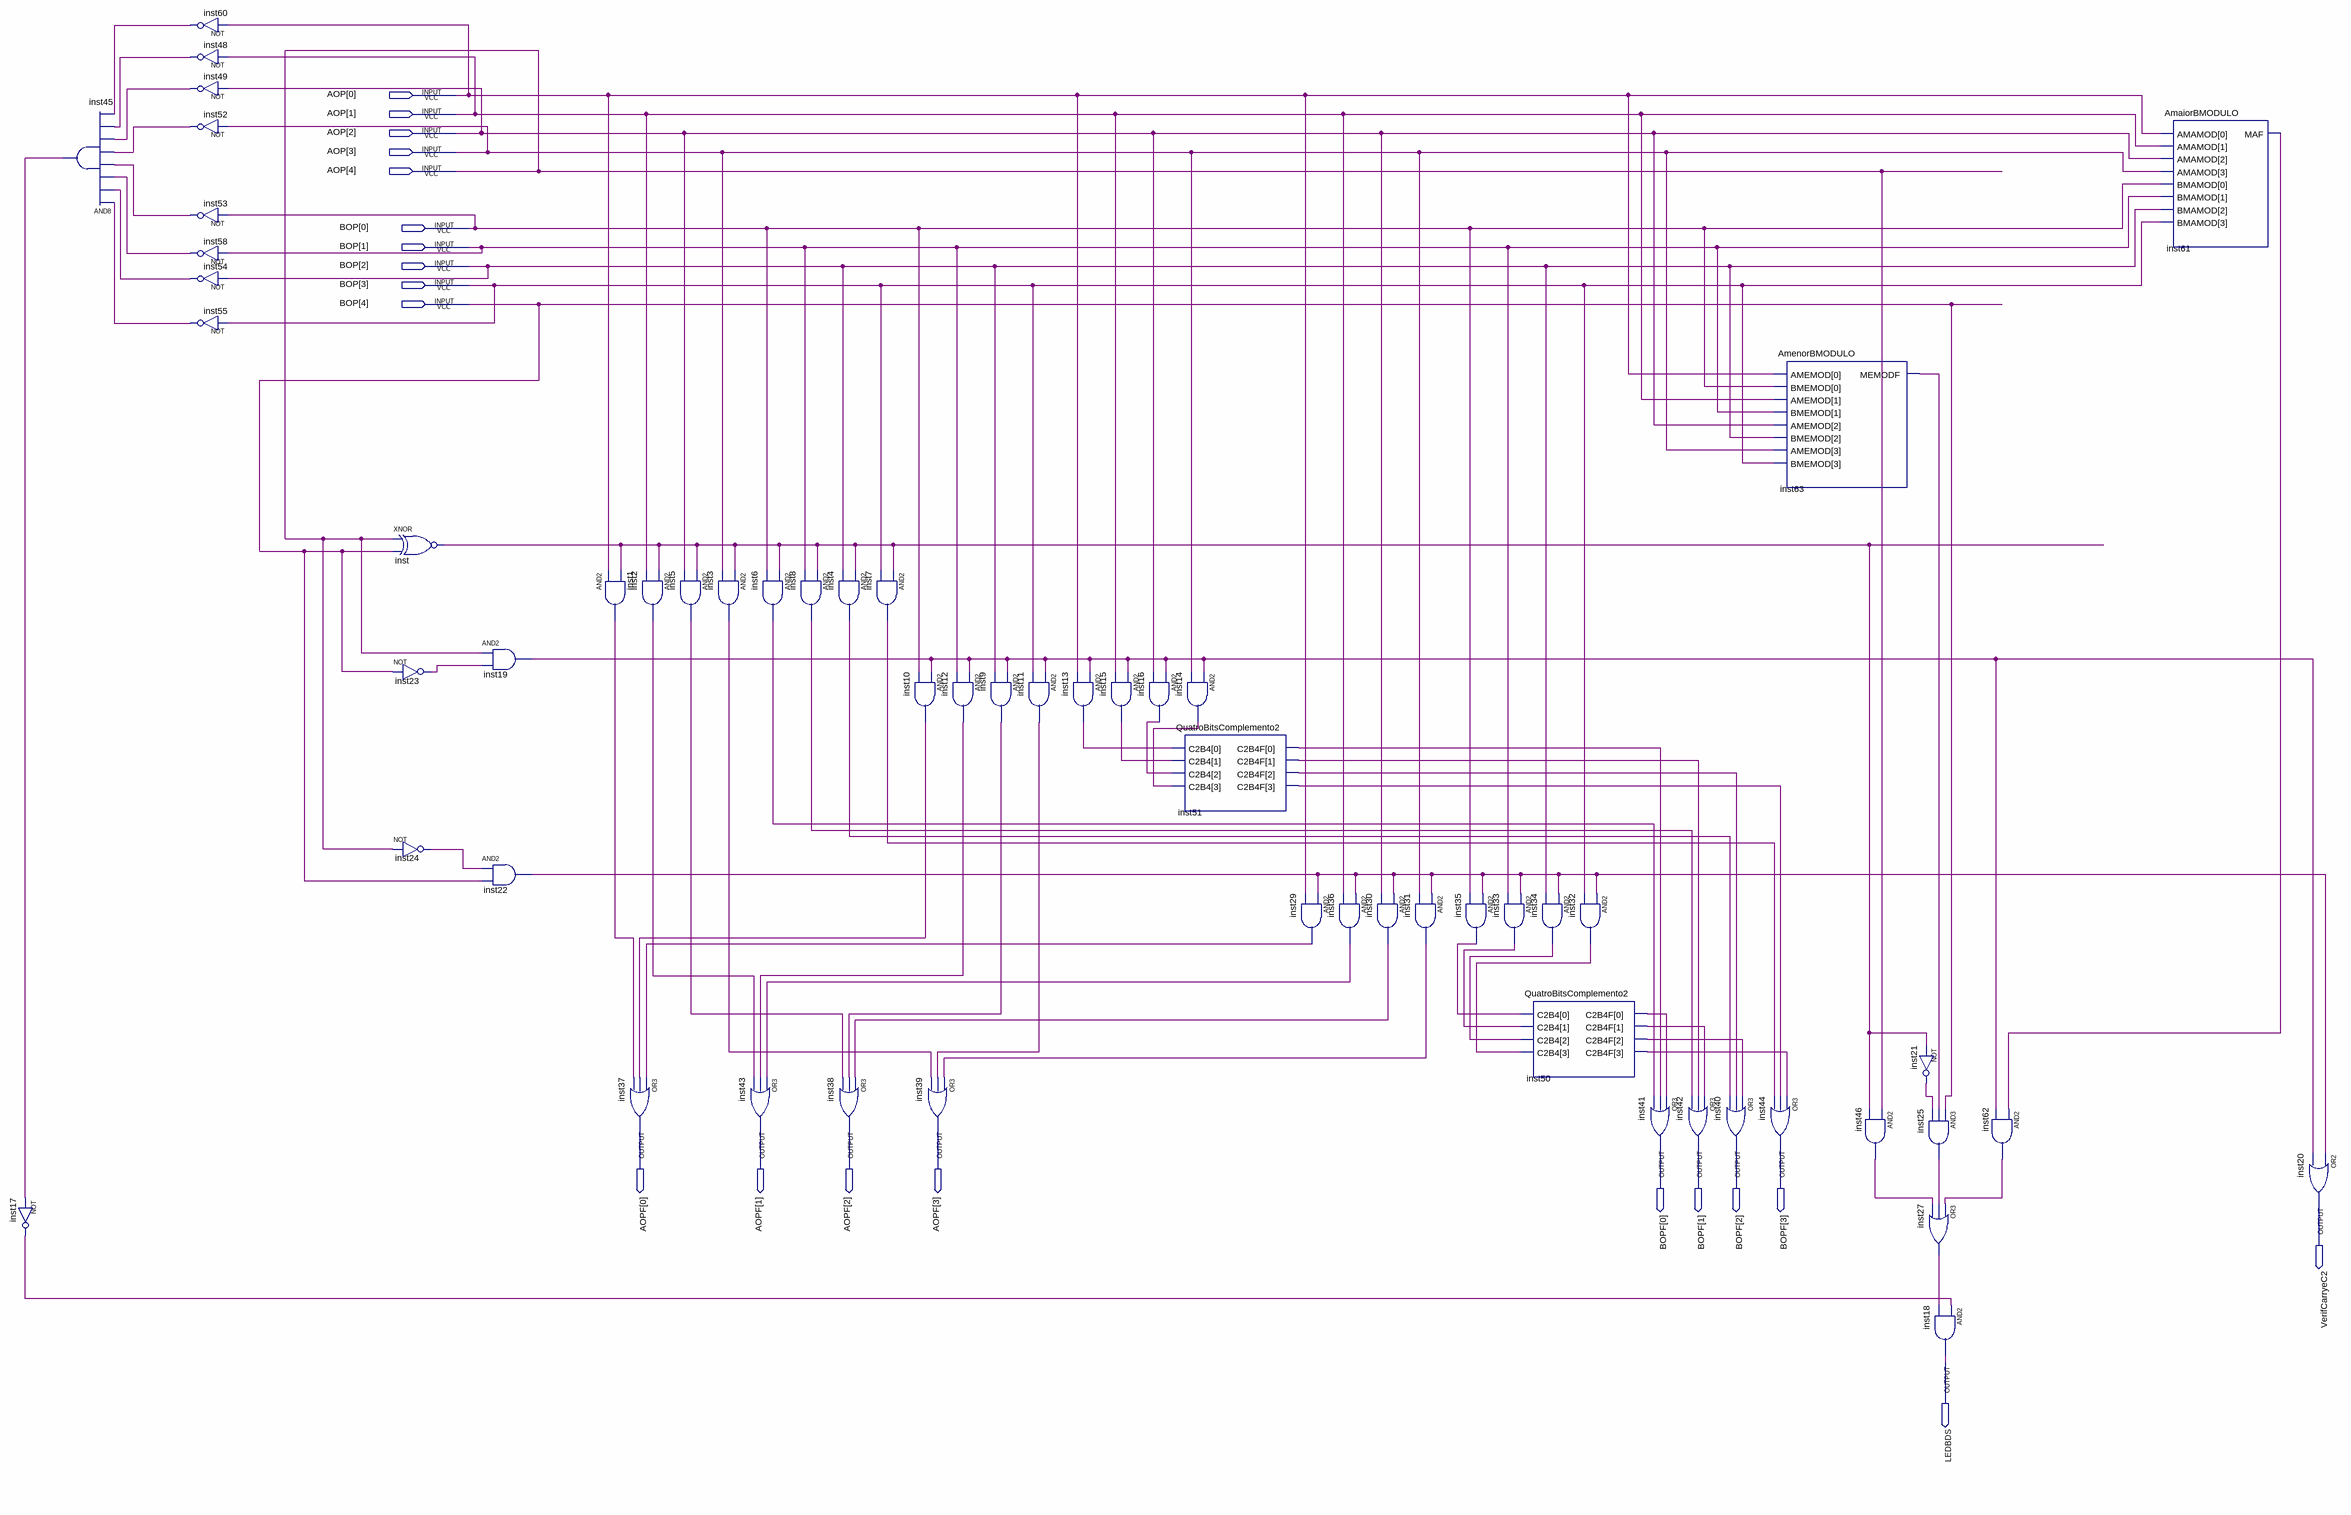
[diagram p0: schematic sheet]
// Quartus schematic OperaAntesSomaSubt.bdf as structural Verilog: 58 symbols, 20 pins
module OperaAntesSomaSubt (
  input  [4:0] AOP,
  input  [4:0] BOP,
  output [3:0] AOPF,
  output [3:0] BOPF,
  output VerifCarryeC2,
  output LEDBDS
);

  wire inst1_out, inst2_out, inst3_out, inst4_out, inst5_out, inst6_out, inst7_out, inst8_out, inst9_out,
       inst10_out, inst11_out, inst12_out, inst13_out, inst14_out, inst15_out, inst16_out, inst17_out,
       inst19_out, inst21_out, inst22_out, inst23_out, inst24_out, inst25_out, inst27_out, inst29_out,
       inst30_out, inst31_out, inst32_out, inst33_out, inst34_out, inst35_out, inst36_out, inst45_out,
       inst46_out, inst48_out, inst49_out, inst50_c2b4f, inst50_c2b4f_2, inst50_c2b4f_3, inst50_c2b4f_4,
       inst51_c2b4f, inst51_c2b4f_2, inst51_c2b4f_3, inst51_c2b4f_4, inst52_out, inst53_out, inst54_out,
       inst55_out, inst58_out, inst60_out, inst61_maf, inst62_out, inst63_memodf, inst_out;

  not inst17 (inst17_out, inst45_out);
  and inst45 (inst45_out, inst55_out, inst54_out, inst58_out, inst53_out, inst52_out, inst49_out, inst48_out, inst60_out);
  not inst60 (inst60_out, AOP[0]);
  not inst48 (inst48_out, AOP[1]);
  not inst49 (inst49_out, AOP[2]);
  not inst52 (inst52_out, AOP[3]);
  not inst53 (inst53_out, BOP[0]);
  not inst58 (inst58_out, BOP[1]);
  not inst54 (inst54_out, BOP[2]);
  not inst55 (inst55_out, BOP[3]);
  xnor inst (inst_out, AOP[4], BOP[4]);
  not inst23 (inst23_out, BOP[4]);
  not inst24 (inst24_out, AOP[4]);
  and inst19 (inst19_out, AOP[4], inst23_out);
  and inst22 (inst22_out, inst24_out, BOP[4]);
  and inst1 (inst1_out, AOP[0], inst_out);
  and inst2 (inst2_out, inst_out, AOP[1]);
  or inst37 (AOPF[0], inst29_out, inst10_out, inst1_out);
  and inst5 (inst5_out, inst_out, AOP[2]);
  and inst3 (inst3_out, inst_out, AOP[3]);
  and inst6 (inst6_out, inst_out, BOP[0]);
  or inst43 (AOPF[1], inst36_out, inst12_out, inst2_out);
  and inst8 (inst8_out, inst_out, BOP[1]);
  and inst4 (inst4_out, inst_out, BOP[2]);
  or inst38 (AOPF[2], inst30_out, inst9_out, inst5_out);
  and inst7 (inst7_out, inst_out, BOP[3]);
  and inst10 (inst10_out, inst19_out, BOP[0]);
  and inst12 (inst12_out, inst19_out, BOP[1]);
  or inst39 (AOPF[3], inst31_out, inst11_out, inst3_out);
  and inst9 (inst9_out, inst19_out, BOP[2]);
  and inst11 (inst11_out, inst19_out, BOP[3]);
  and inst15 (inst15_out, inst19_out, AOP[1]);
  and inst13 (inst13_out, inst19_out, AOP[0]);
  and inst16 (inst16_out, inst19_out, AOP[2]);
  and inst14 (inst14_out, inst19_out, AOP[3]);
  QuatroBitsComplemento2 inst51 (
    .C2B4({inst14_out, inst16_out, inst15_out, inst13_out}),
    .C2B4F({inst51_c2b4f_4, inst51_c2b4f_3, inst51_c2b4f_2, inst51_c2b4f}));
  and inst29 (inst29_out, inst22_out, AOP[0]);
  and inst36 (inst36_out, inst22_out, AOP[1]);
  and inst30 (inst30_out, inst22_out, AOP[2]);
  and inst31 (inst31_out, inst22_out, AOP[3]);
  and inst35 (inst35_out, inst22_out, BOP[0]);
  and inst33 (inst33_out, inst22_out, BOP[1]);
  and inst34 (inst34_out, inst22_out, BOP[2]);
  QuatroBitsComplemento2 inst50 (
    .C2B4({inst32_out, inst34_out, inst33_out, inst35_out}),
    .C2B4F({inst50_c2b4f_3, inst50_c2b4f_2, inst50_c2b4f_4, inst50_c2b4f}));
  and inst32 (inst32_out, inst22_out, BOP[3]);
  or inst41 (BOPF[0], inst50_c2b4f, inst51_c2b4f, inst6_out);
  or inst40 (BOPF[2], inst50_c2b4f_2, inst51_c2b4f_3, inst4_out);
  or inst42 (BOPF[1], inst50_c2b4f_4, inst51_c2b4f_2, inst8_out);
  or inst44 (BOPF[3], inst50_c2b4f_3, inst51_c2b4f_4, inst7_out);
  AmenorBMODULO inst63 (.AMEMOD(AOP[3:0]), .BMEMOD(BOP[3:0]), .MEMODF(inst63_memodf));
  and inst46 (inst46_out, AOP[4], inst_out);
  not inst21 (inst21_out, inst_out);
  and inst25 (inst25_out, BOP[4], inst63_memodf, inst21_out);
  or inst27 (inst27_out, inst62_out, inst25_out, inst46_out);
  and inst18 (LEDBDS, inst17_out, inst27_out);
  and inst62 (inst62_out, inst61_maf, inst19_out);
  AmaiorBMODULO inst61 (.AMAMOD(AOP[3:0]), .BMAMOD(BOP[3:0]), .MAF(inst61_maf));
  or inst20 (VerifCarryeC2, inst22_out, inst19_out);
endmodule
